# EAGLE schematic JdDRangeFinderNew-1 (1) (EAGLE 9.6.2)
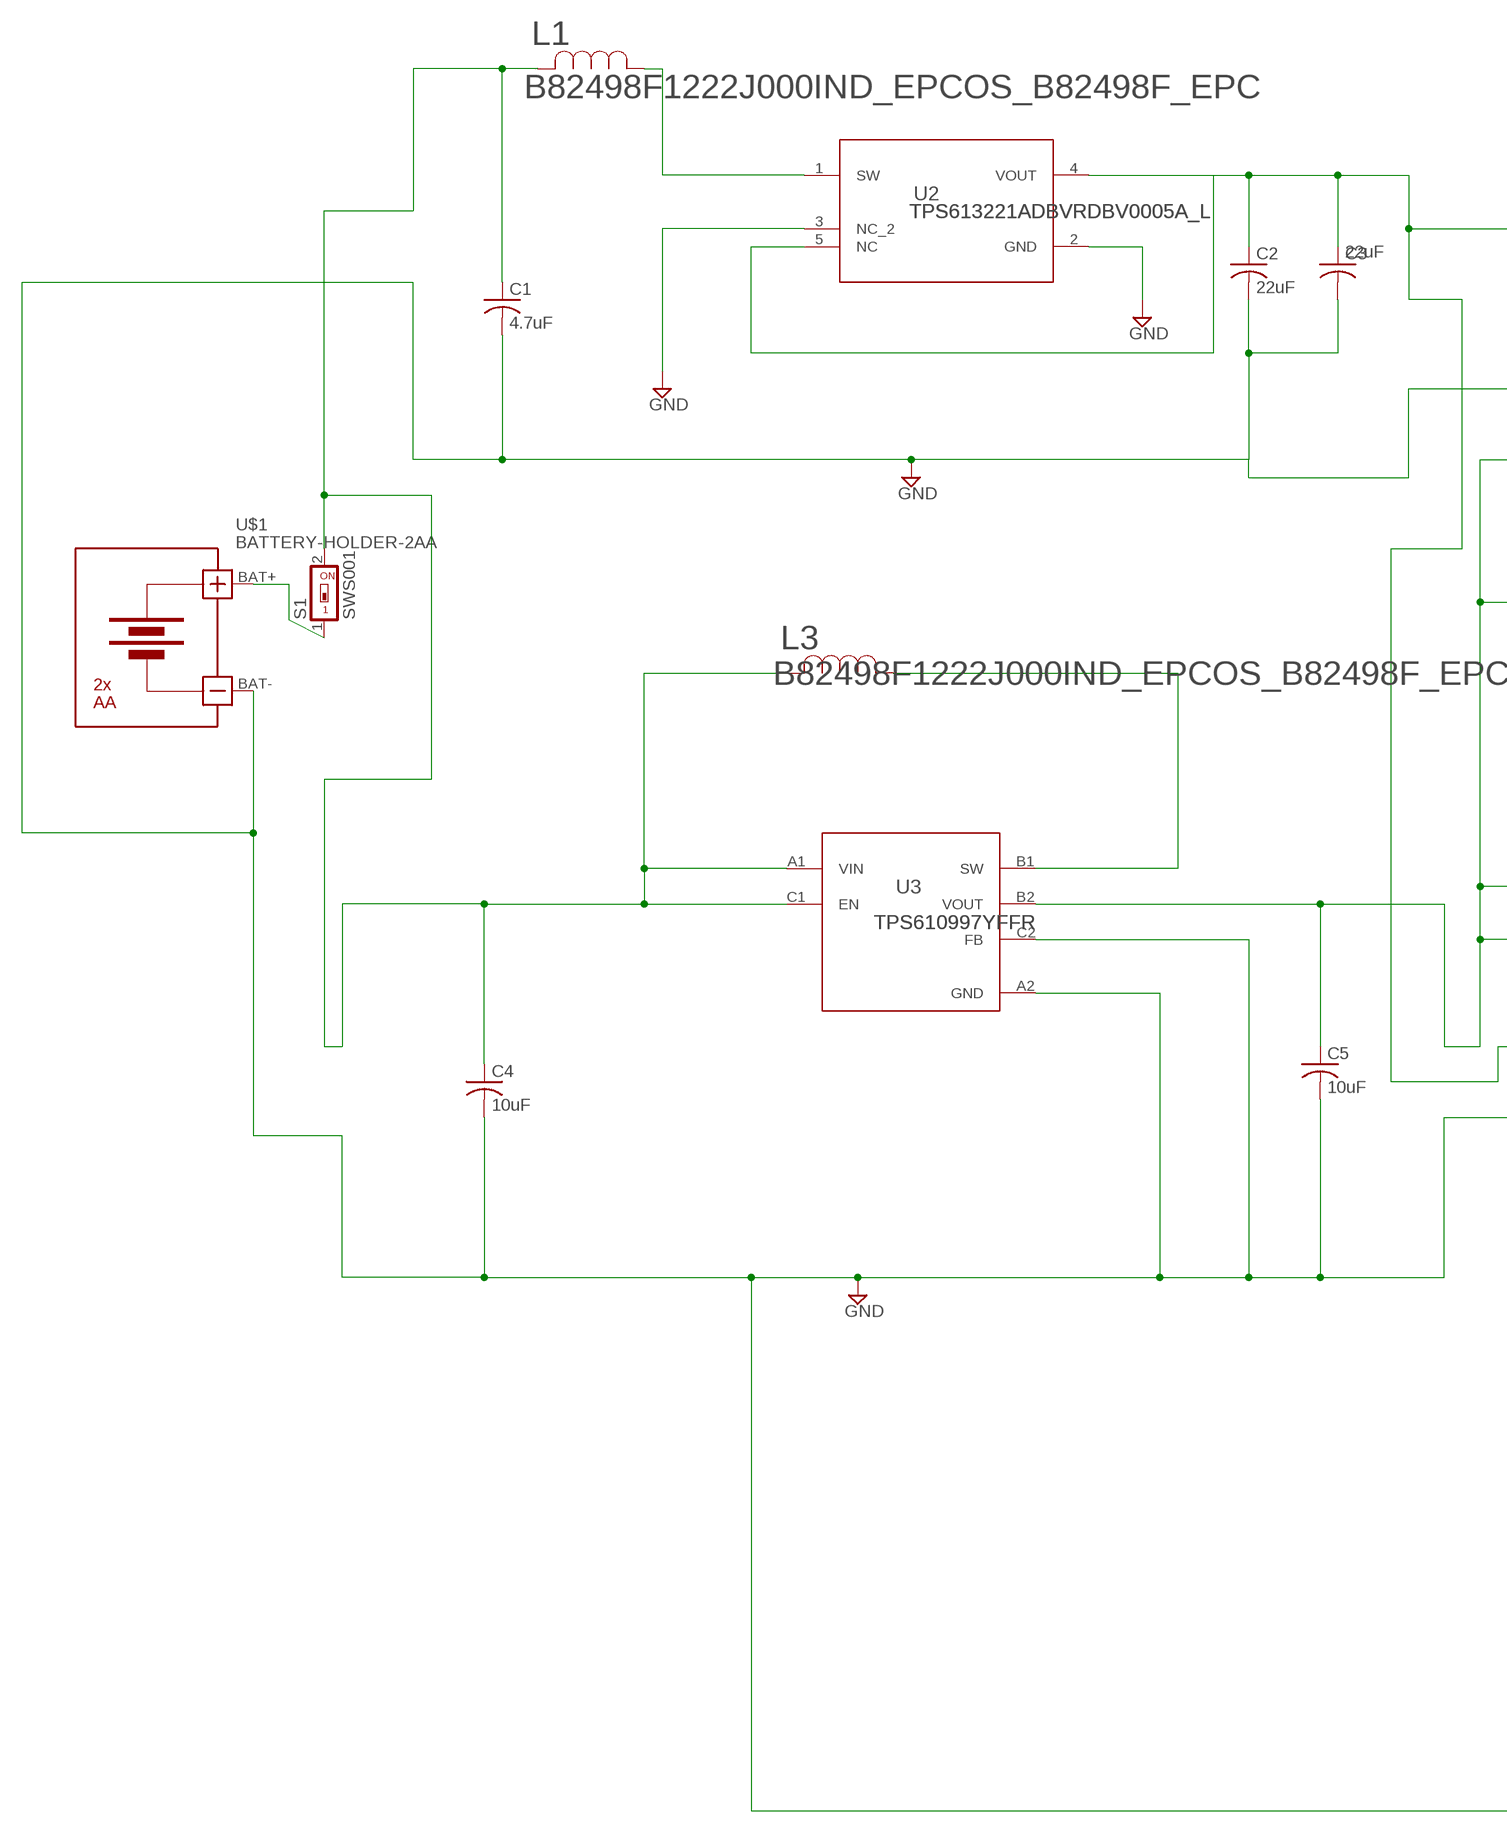
[diagram p0: schematic, sheet 1, part 1 of 2]
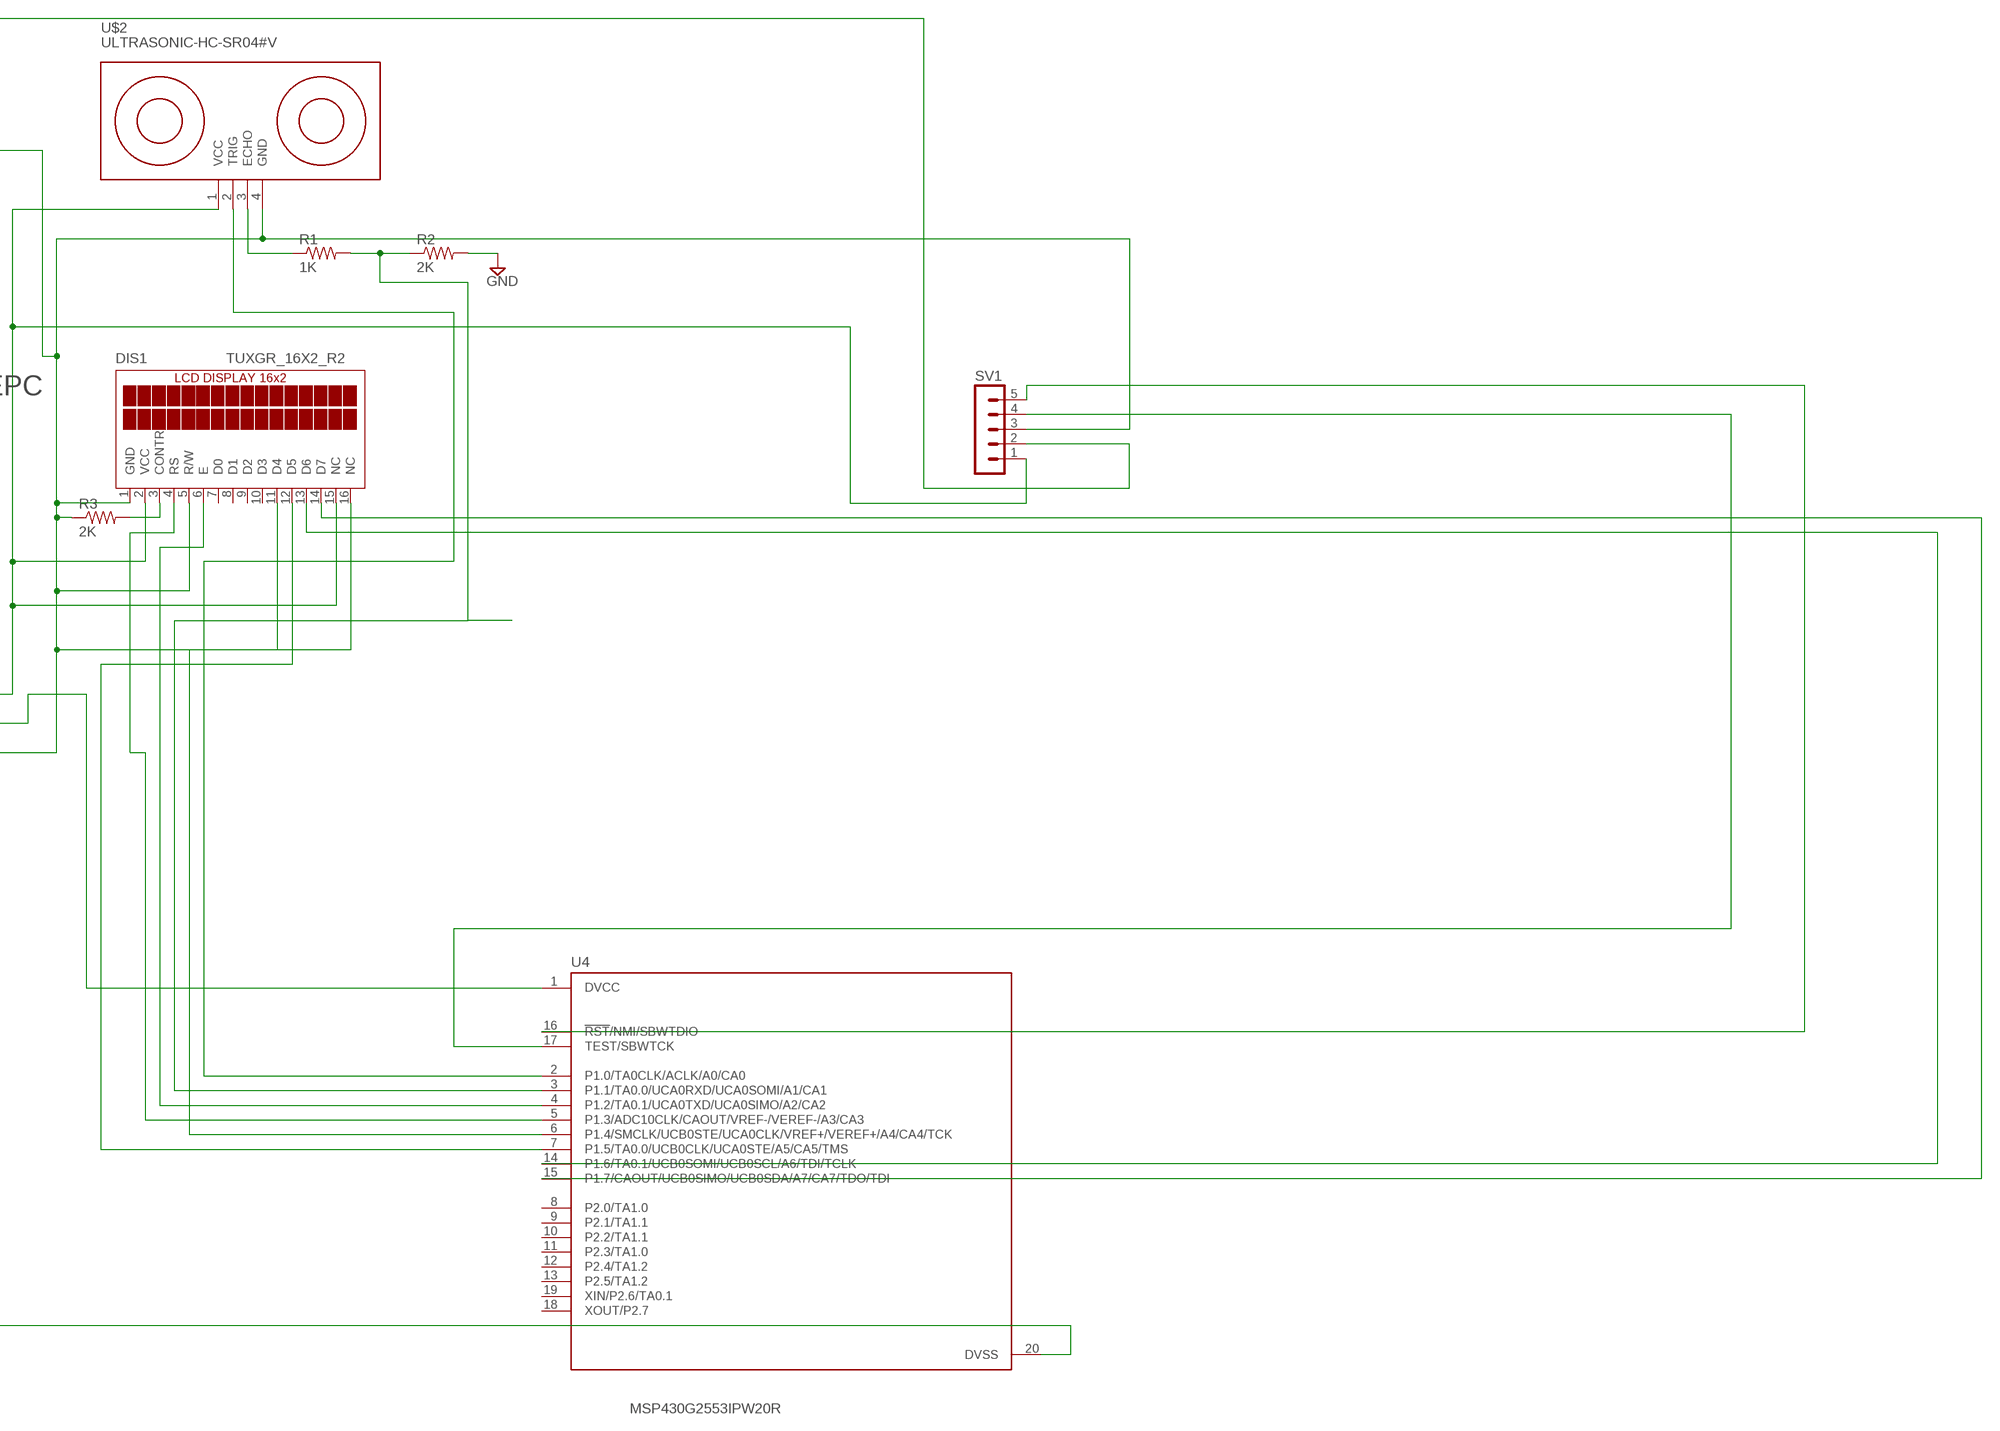
[diagram p1: schematic, sheet 1, part 2 of 2]

## Parts
C1  4.7uF  C-USC0805  [C0805]
C2  22uF  C-USC0805  [C0805]
C3  22uF  C-USC0805  [C0805]
C4  10uF  C-USC0805  [C0805]
C5  10uF  C-USC0805  [C0805]
DIS1  TUXGR_16X2_R2  [TUXGR_16X2_R2]
L1  B82498F1222J000IND_EPCOS_B82498F_EPC  [IND_EPCOS_B82498F_EPC]
L3  B82498F1222J000IND_EPCOS_B82498F_EPC  [IND_EPCOS_B82498F_EPC]
R1  1K  R-US_R0805  [R0805]
R2  2K  R-US_R0805  [R0805]
R3  2K  R-US_R0805  [R0805]
S1  SWS001  [SMS-001]
SV1  MA05-1  [MA05-1]
U2  TPS613221ADBVRDBV0005A_L  [DBV0005A_L]
U3  TPS610997YFFR  [YFF0006AFAD]
U4  MSP430G2553IPW20R  [SOP65P640X120-20N]
U$1  BATTERY-HOLDER-2AA  [BATTERY-HOLDER-2AA]
U$2  ULTRASONIC-HC-SR04#V  [ULTRASONIC-HC-SR04#V]

## Nets
GND: C1.2 C2.2 C3.2 C4.2 C5.2 DIS1.1(GND) DIS1.5(R/W) DIS1.16(NC) R2.2 R3.1 SV1.3 U2.2(GND) U2.3(NC_2) U3.A2(GND) U3.C2(FB) U4.20(DVSS) U$1.BAT- U$2.4(GND)
N$1: SV1.4 U4.17(TEST/SBWTCK)
N$2: C2.1 C3.1 SV1.2 U2.4(VOUT) U2.5(NC) U4.1(DVCC)
N$3: L3.1 U3.B1(SW)
N$4: C5.1 DIS1.2(VCC) DIS1.15(NC) SV1.1 U3.B2(VOUT) U$2.1(VCC)
N$5: U4.2(P1.0/TA0CLK/ACLK/A0/CA0) U$2.2(TRIG)
N$6: R1.1 U$2.3(ECHO)
N$7: C1.1 C4.1 L1.2 L3.2 S1.2 U3.A1(VIN) U3.C1(EN)
N$8: L1.1 U2.1(SW)
N$10: DIS1.4(RS) U4.5(P1.3/ADC10CLK/CAOUT/VREF-/VEREF-/A3/CA3)
N$11: DIS1.6(E) U4.4(P1.2/TA0.1/UCA0TXD/UCA0SIMO/A2/CA2)
N$12: DIS1.11(D4) U4.6(P1.4/SMCLK/UCB0STE/UCA0CLK/VREF+/VEREF+/A4/CA4/TCK)
N$13: DIS1.12(D5) U4.7(P1.5/TA0.0/UCB0CLK/UCA0STE/A5/CA5/TMS)
N$14: DIS1.13(D6) U4.14(P1.6/TA0.1/UCB0SOMI/UCB0SCL/A6/TDI/TCLK)
N$15: DIS1.14(D7) U4.15(P1.7/CAOUT/UCB0SIMO/UCB0SDA/A7/CA7/TDO/TDI)
N$16: DIS1.3(CONTR) R3.2
N$17: S1.1 U$1.BAT+
N$18: SV1.5 U4.16(!RST!/NMI/SBWTDIO)
N$19: R1.2 R2.1 U4.3(P1.1/TA0.0/UCA0RXD/UCA0SOMI/A1/CA1)
Unconnected: DIS1.7(D0) DIS1.8(D1) DIS1.9(D2) DIS1.10(D3) U4.8(P2.0/TA1.0) U4.9(P2.1/TA1.1) U4.10(P2.2/TA1.1) U4.11(P2.3/TA1.0) U4.12(P2.4/TA1.2) U4.13(P2.5/TA1.2) U4.18(XOUT/P2.7) U4.19(XIN/P2.6/TA0.1)

## Library data of the parts
C1-C5 = rcl:C-US: CAPACITOR, American symbol; OC_NEWARK: unknown; SPICEPREFIX: C
DIS1 = display-lcd:TUXGR_16X2_R2: Tuxgraphics LCD display 16x2 characters reflective, without background light Source: tuxgr_12x2_r2.pdf; OC_FARNELL: unknown; OC_NEWARK: unknown
L1 L3 = B82498F1222J000:B82498F1222J000: Check availability <https://pricing.snapeda.com/parts/B82498F1222J000/TDK%20ELECTRONICS/view-part?ref=eda>; AVAILABILITY: In Stock; MF: TDK ELECTRONICS; MP: B82498F1222J000; PACKAGE: None; PRICE: None; PURCHASE-URL: https://pricing.snapeda.com/search/part/B82498F1222J000/?ref=eda
R1-R3 = rcl:R-US_: RESISTOR, American symbol; OC_NEWARK: unknown; SPICEPREFIX: R
S1 = smd-special:SWS001: SMD Dip Switch 1 pol.; OC_NEWARK: unknown
SV1 = con-lstb:MA05-1: PIN HEADER; OC_FARNELL: unknown; OC_NEWARK: unknown
U2 = 3.3:TPS613221ADBVR; COPYRIGHT: Copyright (C) 2022 Ultra Librarian. All rights reserved.; MANUFACTURER_PART_NUMBER: TPS613221ADBVR; MFR_NAME: Texas Instruments; OC_NEWARK: unknown; REFDES: RefDes; TYPE: TYPE
U3 = 5:TPS610997YFFR; COPYRIGHT: Copyright (C) 2022 Ultra Librarian. All rights reserved.; MANUFACTURER_PART_NUMBER: TPS610997YFFR; MFR_NAME: Texas Instruments; OC_NEWARK: unknown; REFDES: RefDes; TYPE: TYPE
U4 = MSP430G2553IPW20R:MSP430G2553IPW20R: 16 MHz MCU with 16KB FLASH, 512B SRAM, 10-bit ADC, Comparator, UART/SPI/I2C, Timer 20-TSSOP -40 to 85 Check availability <https://pricing.snapeda.com/parts/MSP430G2553IPW20R/Texas%20Instruments/view-part?ref=eda>; AVAILABILITY: In Stock; DESCRIPTION: 16 MHz MCU with 16KB Flash, 512B SRAM, comparator, UART/SPI/I2C, timer; MF: Texas Instruments; MP: MSP430G2553IPW20R; PACKAGE: TSSOP-20 Texas Instruments; PRICE: None; PURCHASE-URL: https://pricing.snapeda.com/search/part/MSP430G2553IPW20R/?ref=eda
U$1 = 6 diy-modules:BATTERY-HOLDER-2AA: Battery Holder 2 x AA Click here to find device on ebay.com <http://www.ebay.com/sch/battery+plastic+holder+aa+2x1.5v>; OC_NEWARK: unknown
U$2 = 6 diy-modules:ULTRASONIC-HC-SR04: Ultrasonic Ranging Module HC-SR04 More details available here: http://randomnerdtutorials.com/complete-guide-for-ultrasonic-sensor-hc-sr04/ Click here to find device on ebay.com <http://www.ebay.com/sch/hc+sr04+ultrasonic>; OC_NEWARK: unknown